# Altium schematic sheet UART.SchDoc
size A4; SheetNumber: 4; SheetTotal: 8
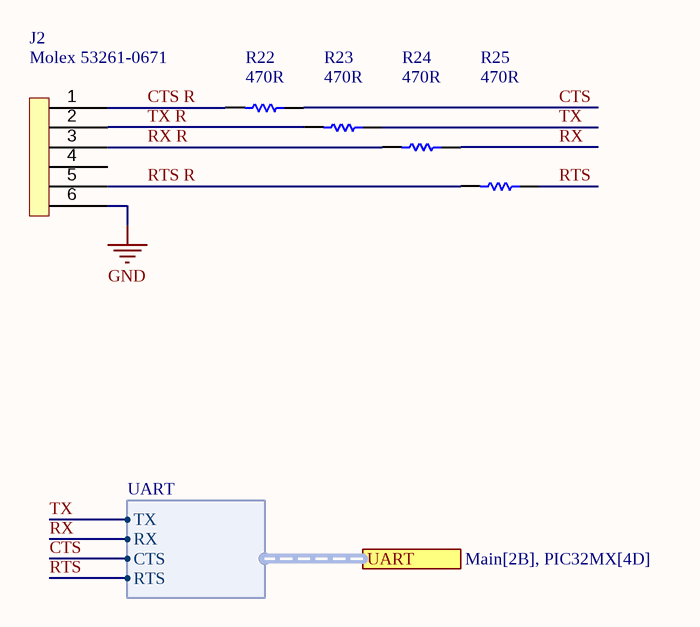
[diagram p0: UART.SchDoc]

## Parts
J2  Molex 53261-0671  [Molex 53261-0671]
R22  470R  [Resistor 0603]
R23  470R  [Resistor 0603]
R24  470R  [Resistor 0603]
R25  470R  [Resistor 0603]

## Ports
UART (harness UART, see Main[2B], PIC32MX[4D])

## Harnesses
UART: TX, RX, CTS, RTS

## Nets
GND: J2.6
CTS: R22.2 ; port UART.CTS
CTS R: J2.1 R22.1
RTS: R25.2 ; port UART.RTS
RTS R: J2.5 R25.1
RX: R24.2 ; port UART.RX
RX R: J2.3 R24.1
TX: R23.2 ; port UART.TX
TX R: J2.2 R23.1

Not connected (* = marked no-connect by the designer): J2 4

## Notes on the sheet
- TITLE
- SIZE
- A4
- VARIANT
- PROJECT
- SHEET
- VERSION
- OF
- AUTHOR
- DATE

## Library data of the parts
R22-R25 = Resistor